# EAGLE design LimitSwitch (EAGLE 9.6.2)
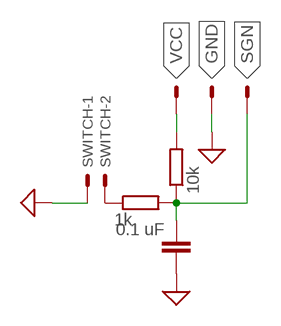
[diagram p0: schematic, sheet 1]

## Parts
C1  0.1 uF  C-EUC1206  [C1206]
INPUT  22-23-2031  [22-23-2031]
R3  10k  R-EU_R1206  [R1206]
R4  1k  R-EU_R1206  [R1206]
SWITCH  22-23-2021  [22-23-2021]

## Nets
GND: C1.2 INPUT.2 SWITCH.1 ; supply symbol labelled SUP
N$1: R4.1 SWITCH.2
SGN: C1.1 INPUT.3 R3.1 R4.2
VCC: INPUT.1 R3.2

## Library data of the parts
C1 = rcl:C-EU: CAPACITOR, European symbol; SPICEPREFIX: C
INPUT = con-molex:22-23-2031: .100" (2.54mm) Center Header - 3 Pin; MF: MOLEX; MPN: 22-23-2031; OC_FARNELL: 1462950; OC_NEWARK: 30C0862
R3 R4 = rcl:R-EU_: RESISTOR, European symbol; SPICEPREFIX: R
SWITCH = con-molex:22-23-2021: .100" (2.54mm) Center Header - 2 Pin; MF: MOLEX; MPN: 22-23-2021; OC_FARNELL: 1462926; OC_NEWARK: 25C3832

## Net classes
0 default: width 0.305 mm, drill 0.508 mm, clearance 0.254 mm

## Board
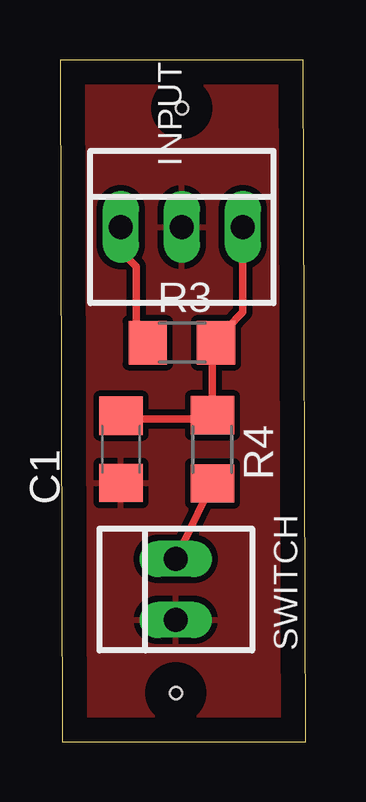
[diagram p1: board, top side]

Size 10.24 x 28.42 mm. Coordinates in mm from the lower left corner, seen from the top.
Outline: 0.1,0 10.24,0 10.14,28.42 0,28.42 0.1,0
Copper layers (1*16): Top 0.035mm / dielectric 1.5mm / Bottom 0.035mm
Design rules "default": minimum track width 6mil, minimum drill 0.35mm, track to track 6mil, track to pad 6mil, pad to pad 6mil, via to via 6mil, smd to smd 6mil, copper to edge 40mil, drill to drill 6mil, minimum pad ring 10mil, minimum via ring 8mil, stop-mask expansion 4mil, vias tented up to drill 0mil, thermal gap 10mil
Holes 0.51 mm at 5.08,26.41 4.83,2.02

### Footprints (pad centres in the part's own frame; a part is rotated, then mirrored left to right if it is on the bottom)
C1206 = smd 1.6 x 1.8: 1 -1.4,0; 2 1.4,0
22-23-2031 = drill 1 long: 1 -2.54,0; 2 0,0; 3 2.54,0
R1206 = smd 1.6 x 1.803: 1 -1.422,0; 2 1.422,0
22-23-2021 = drill 1 long: 1 -1.27,0; 2 1.27,0

### Placement (x,y rotation side)
C1  2.54,12.18 270 top
INPUT  5.08,21.46 0 top
R3  5.08,16.63 180 top
R4  6.35,12.18 90 top
SWITCH  4.83,6.34 90 top

### Tracks (layer width: path | path; a pad name or v marks a point on that pad's centre or on a via)
GND
  pour Top: -12.7,29.96 -7.62,35.04 17.78,35.04 22.86,29.96 22.86,-14.49 17.78,-19.57 -7.62,-19.57 -13.97,-13.22 -13.97,28.69
  pour Top: -0.51,29.96 10.16,29.96 12.45,27.68 12.45,1.52 9.14,-1.79 1.27,-1.79 -2.03,1.52 -2.03,28.44
N$1
  Top 0.305: SWITCH.2 R4.1
SGN
  Top 0.305: C1.1 2.54,13.45 6.35,13.45 R4.2 6.35,16.63 R3.1 6.98,16.63 6.98,17.26 7.62,17.9 INPUT.3
VCC
  Top 0.305: INPUT.1 2.54,20.44 3.17,19.8 3.17,16.63 R3.2